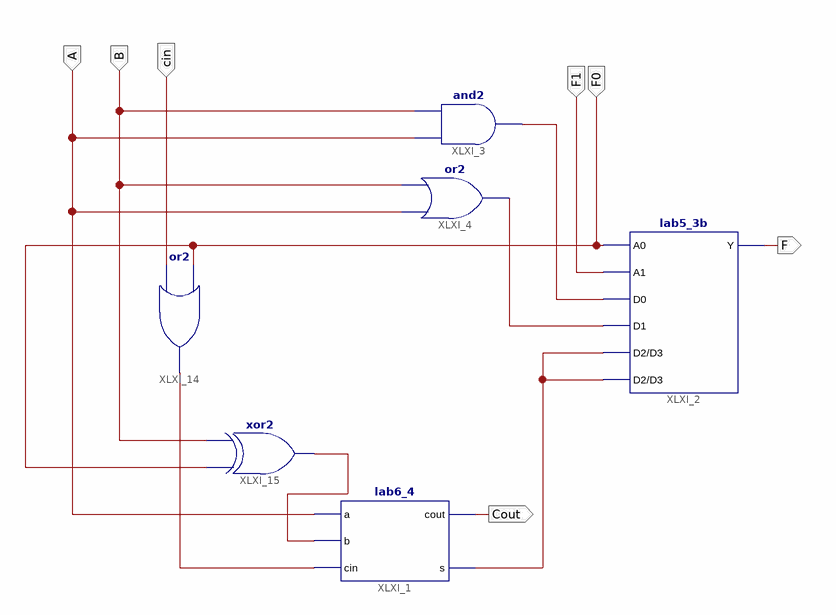
[diagram p0: schematic sheet 1]
// Xilinx ISE schematic fisier_schematic.sch (spartan3e) as structural Verilog: 6 symbols, 7 ports
module fisier_schematic (
  input  F0,
  input  F1,
  input  A,
  input  cin,
  input  B,
  output Cout,
  output F
);

  wire XLXN_8, XLXN_9, XLXN_10, XLXN_20, XLXN_21;

  lab6_4 XLXI_1 (.a(A), .b(XLXN_21), .cin(XLXN_20), .cout(Cout), .s(XLXN_8));
  lab5_3b XLXI_2 (.A0(F0), .A1(F1), .D0(XLXN_10), .D1(XLXN_9), .D2(XLXN_8), .D3(XLXN_8), .Y(F));
  and XLXI_3 (XLXN_10, A, B);
  or XLXI_4 (XLXN_9, A, B);
  or XLXI_14 (XLXN_20, cin, F0);
  xor XLXI_15 (XLXN_21, F0, B);
endmodule
